# EAGLE design untitled (EAGLE 9.6.2)
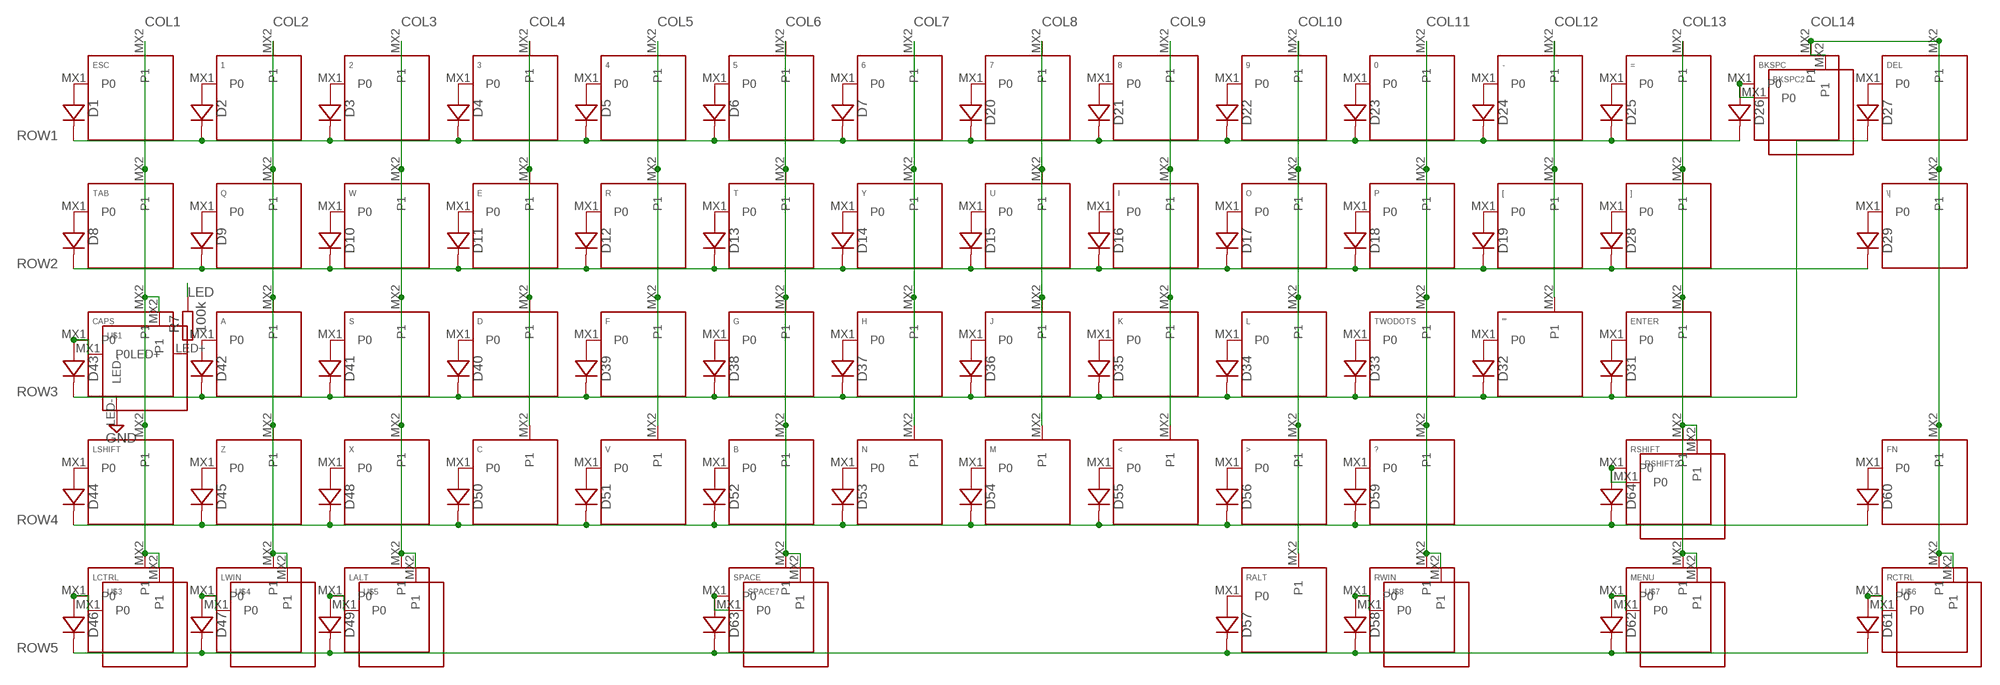
[diagram p0: schematic, sheet 1, part 1 of 2]
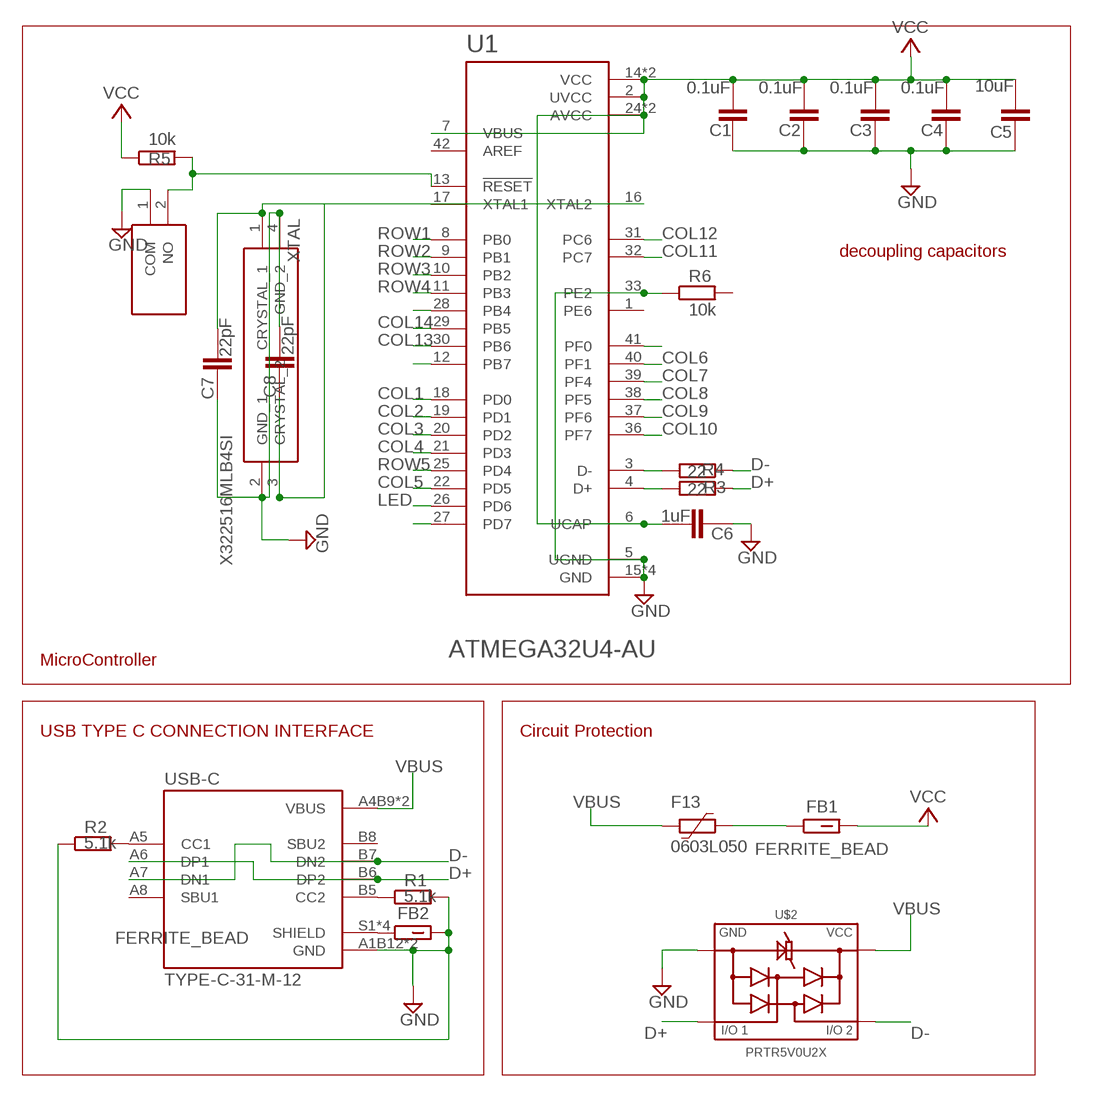
[diagram p1: schematic, sheet 1, part 2 of 2]

## Parts
0  KEYSWITCH-PLAIN-MX-1U  [MX-1U]
1  KEYSWITCH-PLAIN-MX-1U  [MX-1U]
2  KEYSWITCH-PLAIN-MX-1U  [MX-1U]
3  KEYSWITCH-PLAIN-MX-1U  [MX-1U]
4  KEYSWITCH-PLAIN-MX-1U  [MX-1U]
5  KEYSWITCH-PLAIN-MX-1U  [MX-1U]
6  KEYSWITCH-PLAIN-MX-1U  [MX-1U]
7  KEYSWITCH-PLAIN-MX-1U  [MX-1U]
8  KEYSWITCH-PLAIN-MX-1U  [MX-1U]
9  KEYSWITCH-PLAIN-MX-1U  [MX-1U]
'"  KEYSWITCH-PLAIN-MX-1U  [MX-1U]
-  KEYSWITCH-PLAIN-MX-1U  [MX-1U]
<  KEYSWITCH-PLAIN-MX-1U  [MX-1U]
=  KEYSWITCH-PLAIN-MX-1U  [MX-1U]
>  KEYSWITCH-PLAIN-MX-1U  [MX-1U]
?  KEYSWITCH-PLAIN-MX-1U  [MX-1U]
[  KEYSWITCH-PLAIN-MX-1U  [MX-1U]
\|  KEYSWITCH-PLAIN-MX-1U  [MX-1U]
]  KEYSWITCH-PLAIN-MX-1U  [MX-1U]
A  KEYSWITCH-PLAIN-MX-1U  [MX-1U]
B  KEYSWITCH-PLAIN-MX-1U  [MX-1U]
BKSPC  KEYSWITCH-PLAIN-MX-1U  [MX-1U]
BKSPC2  KEYSWITCH-PLAIN-MX-2U  [MX-2U]
C  KEYSWITCH-PLAIN-MX-1U  [MX-1U]
C1  0.1uF  CAPACITOR-0603  [C0603]
C2  0.1uF  CAPACITOR-0603  [C0603]
C3  0.1uF  CAPACITOR-0603  [C0603]
C4  0.1uF  CAPACITOR-0603  [C0603]
C5  10uF  CAPACITOR-0603  [C0603]
C6  1uF  CAPACITOR-0603  [C0603]
C7  22pF  CAPACITOR-0603  [C0603]
C8  22pF  CAPACITOR-0603  [C0603]
CAPS  KEYSWITCH-LED-MX-1U-LED  [MX-1U-LED]
D  KEYSWITCH-PLAIN-MX-1U  [MX-1U]
D1  DIODE-SOD-123  [SOD-123]
D2  DIODE-SOD-123  [SOD-123]
D3  DIODE-SOD-123  [SOD-123]
D4  DIODE-SOD-123  [SOD-123]
D5  DIODE-SOD-123  [SOD-123]
D6  DIODE-SOD-123  [SOD-123]
D7  DIODE-SOD-123  [SOD-123]
D8  DIODE-SOD-123  [SOD-123]
D9  DIODE-SOD-123  [SOD-123]
D10  DIODE-SOD-123  [SOD-123]
D11  DIODE-SOD-123  [SOD-123]
D12  DIODE-SOD-123  [SOD-123]
D13  DIODE-SOD-123  [SOD-123]
D14  DIODE-SOD-123  [SOD-123]
D15  DIODE-SOD-123  [SOD-123]
D16  DIODE-SOD-123  [SOD-123]
D17  DIODE-SOD-123  [SOD-123]
D18  DIODE-SOD-123  [SOD-123]
D19  DIODE-SOD-123  [SOD-123]
D20  DIODE-SOD-123  [SOD-123]
D21  DIODE-SOD-123  [SOD-123]
D22  DIODE-SOD-123  [SOD-123]
D23  DIODE-SOD-123  [SOD-123]
D24  DIODE-SOD-123  [SOD-123]
D25  DIODE-SOD-123  [SOD-123]
D26  DIODE-SOD-123  [SOD-123]
D27  DIODE-SOD-123  [SOD-123]
D28  DIODE-SOD-123  [SOD-123]
D29  DIODE-SOD-123  [SOD-123]
D31  DIODE-SOD-123  [SOD-123]
D32  DIODE-SOD-123  [SOD-123]
D33  DIODE-SOD-123  [SOD-123]
D34  DIODE-SOD-123  [SOD-123]
D35  DIODE-SOD-123  [SOD-123]
D36  DIODE-SOD-123  [SOD-123]
D37  DIODE-SOD-123  [SOD-123]
D38  DIODE-SOD-123  [SOD-123]
D39  DIODE-SOD-123  [SOD-123]
D40  DIODE-SOD-123  [SOD-123]
D41  DIODE-SOD-123  [SOD-123]
D42  DIODE-SOD-123  [SOD-123]
D43  DIODE-SOD-123  [SOD-123]
D44  DIODE-SOD-123  [SOD-123]
D45  DIODE-SOD-123  [SOD-123]
D46  DIODE-SOD-123  [SOD-123]
D47  DIODE-SOD-123  [SOD-123]
D48  DIODE-SOD-123  [SOD-123]
D49  DIODE-SOD-123  [SOD-123]
D50  DIODE-SOD-123  [SOD-123]
D51  DIODE-SOD-123  [SOD-123]
D52  DIODE-SOD-123  [SOD-123]
D53  DIODE-SOD-123  [SOD-123]
D54  DIODE-SOD-123  [SOD-123]
D55  DIODE-SOD-123  [SOD-123]
D56  DIODE-SOD-123  [SOD-123]
D57  DIODE-SOD-123  [SOD-123]
D58  DIODE-SOD-123  [SOD-123]
D59  DIODE-SOD-123  [SOD-123]
D60  DIODE-SOD-123  [SOD-123]
D61  DIODE-SOD-123  [SOD-123]
D62  DIODE-SOD-123  [SOD-123]
D63  DIODE-SOD-123  [SOD-123]
D64  DIODE-SOD-123  [SOD-123]
DEL  KEYSWITCH-PLAIN-MX-1U  [MX-1U]
E  KEYSWITCH-PLAIN-MX-1U  [MX-1U]
ENTER  KEYSWITCH-PLAIN-MX-2U  [MX-2U]
ESC  KEYSWITCH-PLAIN-MX-1U  [MX-1U]
F  KEYSWITCH-PLAIN-MX-1U  [MX-1U]
F13  0603L050  [0603L]
FB1  FERRITE_BEAD  FBCHIP-0603(1608-METRIC)  [BEADC1608X95N]
FB2  FERRITE_BEAD  FBCHIP-0603(1608-METRIC)  [BEADC1608X95N]
FN  KEYSWITCH-PLAIN-MX-1U  [MX-1U]
G  KEYSWITCH-PLAIN-MX-1U  [MX-1U]
H  KEYSWITCH-PLAIN-MX-1U  [MX-1U]
I  KEYSWITCH-PLAIN-MX-1U  [MX-1U]
J  KEYSWITCH-PLAIN-MX-1U  [MX-1U]
K  KEYSWITCH-PLAIN-MX-1U  [MX-1U]
L  KEYSWITCH-PLAIN-MX-1U  [MX-1U]
LALT  KEYSWITCH-PLAIN-MX-1U  [MX-1U]
LCTRL  KEYSWITCH-PLAIN-MX-1U  [MX-1U]
LSHIFT  KEYSWITCH-PLAIN-MX-2U  [MX-2U]
LWIN  KEYSWITCH-PLAIN-MX-1U  [MX-1U]
M  KEYSWITCH-PLAIN-MX-1U  [MX-1U]
MENU  KEYSWITCH-PLAIN-MX-1U  [MX-1U]
N  KEYSWITCH-PLAIN-MX-1U  [MX-1U]
O  KEYSWITCH-PLAIN-MX-1U  [MX-1U]
P  KEYSWITCH-PLAIN-MX-1U  [MX-1U]
Q  KEYSWITCH-PLAIN-MX-1U  [MX-1U]
R  KEYSWITCH-PLAIN-MX-1U  [MX-1U]
R1  5.1k  RESISTOR-0603  [R0603]
R2  5.1k  RESISTOR-0603  [R0603]
R3  22  RESISTOR-0603  [R0603]
R4  22  RESISTOR-0603  [R0603]
R5  10k  RESISTOR-0603  [R0603]
R6  10k  RESISTOR-0603  [R0603]
R7  100k  RESISTOR-0603  [R0603]
RALT  KEYSWITCH-PLAIN-MX-1U  [MX-1U]
RCTRL  KEYSWITCH-PLAIN-MX-1U  [MX-1U]
RSHIFT  KEYSWITCH-PLAIN-MX-1U  [MX-1U]
RSHIFT2  KEYSWITCH-PLAIN-MX-2U  [MX-2U]
RWIN  KEYSWITCH-PLAIN-MX-1U  [MX-1U]
S  KEYSWITCH-PLAIN-MX-1U  [MX-1U]
S1  EVP-AWBD2A  [EVPAWBD4A]
SPACE  KEYSWITCH-PLAIN-MX-6.25U-FLIPPED  [MX-6.25U-FLIPPED]
SPACE7  KEYSWITCH-PLAIN-MX-7U-FLIPPED  [MX-7U-FLIPPED]
T  KEYSWITCH-PLAIN-MX-1U  [MX-1U]
TAB  KEYSWITCH-PLAIN-MX-1U  [MX-1U]
TWODOTS  KEYSWITCH-PLAIN-MX-1U  [MX-1U]
U  KEYSWITCH-PLAIN-MX-1U  [MX-1U]
U1  ATMEGA32U4-AU  [QFP80P1200X1200X120-44N]
U$1  KEYSWITCH-PLAIN-MX-1U  [MX-1U]
U$2  PRTR5V0U2X  [PRTR5V0U2X]
U$3  KEYSWITCH-PLAIN-MX-1U  [MX-1U]
U$4  KEYSWITCH-PLAIN-MX-1U  [MX-1U]
U$5  KEYSWITCH-PLAIN-MX-1U  [MX-1U]
U$6  KEYSWITCH-PLAIN-MX-1U  [MX-1U]
U$7  KEYSWITCH-PLAIN-MX-1U  [MX-1U]
U$8  KEYSWITCH-PLAIN-MX-1U  [MX-1U]
USB-C  TYPE-C-31-M-12  [HRO_TYPE-C-31-M-12]
V  KEYSWITCH-PLAIN-MX-1U  [MX-1U]
W  KEYSWITCH-PLAIN-MX-1U  [MX-1U]
X  KEYSWITCH-PLAIN-MX-1U  [MX-1U]
XTAL  X322516MLB4SI  [X322516MLB4SI]
Y  KEYSWITCH-PLAIN-MX-1U  [MX-1U]
Z  KEYSWITCH-PLAIN-MX-1U  [MX-1U]

## Nets
COL1: CAPS.MX2(P1) ESC.MX2(P1) LCTRL.MX2(P1) LSHIFT.MX2(P1) TAB.MX2(P1) U1.18(PD0) U$1.MX2(P1) U$3.MX2(P1)
COL2: 1.MX2(P1) A.MX2(P1) LWIN.MX2(P1) Q.MX2(P1) U1.19(PD1) U$4.MX2(P1) Z.MX2(P1)
COL3: 2.MX2(P1) LALT.MX2(P1) S.MX2(P1) U1.20(PD2) U$5.MX2(P1) W.MX2(P1) X.MX2(P1)
COL4: 3.MX2(P1) C.MX2(P1) D.MX2(P1) E.MX2(P1) U1.21(PD3)
COL5: 4.MX2(P1) F.MX2(P1) R.MX2(P1) U1.22(PD5) V.MX2(P1)
COL6: 5.MX2(P1) B.MX2(P1) G.MX2(P1) SPACE7.MX2(P1) SPACE.MX2(P1) T.MX2(P1) U1.40(PF1)
COL7: 6.MX2(P1) H.MX2(P1) N.MX2(P1) U1.39(PF4) Y.MX2(P1)
COL8: 7.MX2(P1) J.MX2(P1) M.MX2(P1) U1.38(PF5) U.MX2(P1)
COL9: 8.MX2(P1) <.MX2(P1) I.MX2(P1) K.MX2(P1) U1.37(PF6)
COL10: 9.MX2(P1) >.MX2(P1) L.MX2(P1) O.MX2(P1) RALT.MX2(P1) U1.36(PF7)
COL11: 0.MX2(P1) ?.MX2(P1) P.MX2(P1) RWIN.MX2(P1) TWODOTS.MX2(P1) U1.32(PC7) U$8.MX2(P1)
COL12: '".MX2(P1) -.MX2(P1) [.MX2(P1) U1.31(PC6)
COL13: =.MX2(P1) ].MX2(P1) ENTER.MX2(P1) MENU.MX2(P1) RSHIFT2.MX2(P1) RSHIFT.MX2(P1) U1.30(PB6) U$7.MX2(P1)
COL14: \|.MX2(P1) BKSPC2.MX2(P1) BKSPC.MX2(P1) DEL.MX2(P1) FN.MX2(P1) RCTRL.MX2(P1) U1.29(PB5) U$6.MX2(P1)
D+: R4.1 U$2.2 USB-C.A6(DP1) USB-C.B6(DP2)
D-: R3.1 U$2.3 USB-C.A7(DN1) USB-C.B7(DN2)
GND: C1.1 C2.1 C3.1 C4.1 C5.1 C6.1 C7.1 C8.2 CAPS.LED- FB2.2 R1.2 R2.1 R6.1 S1.1(COM) U1.5(UGND) U1.15(GND) U1.23(GND) U1.33(PE2) U1.35(GND) U1.43(GND) U$2.1 USB-C.A1B12(GND) USB-C.B1A12(GND) XTAL.2(GND_1) XTAL.4(GND_2)
LED: R7.2 U1.26(PD6)
N$1: D1.A ESC.MX1(P0)
N$2: 1.MX1(P0) D2.A
N$3: 2.MX1(P0) D3.A
N$4: 3.MX1(P0) D4.A
N$5: 4.MX1(P0) D5.A
N$6: 5.MX1(P0) D6.A
N$7: 6.MX1(P0) D7.A
N$8: D8.A TAB.MX1(P0)
N$9: D9.A Q.MX1(P0)
N$10: D10.A W.MX1(P0)
N$11: D11.A E.MX1(P0)
N$12: D12.A R.MX1(P0)
N$13: D13.A T.MX1(P0)
N$14: D14.A Y.MX1(P0)
N$15: D15.A U.MX1(P0)
N$16: D16.A I.MX1(P0)
N$17: D17.A O.MX1(P0)
N$18: D18.A P.MX1(P0)
N$19: [.MX1(P0) D19.A
N$20: 7.MX1(P0) D20.A
N$21: 8.MX1(P0) D21.A
N$22: 9.MX1(P0) D22.A
N$23: 0.MX1(P0) D23.A
N$24: -.MX1(P0) D24.A
N$25: =.MX1(P0) D25.A
N$26: BKSPC2.MX1(P0) BKSPC.MX1(P0) D26.A
N$27: D27.A DEL.MX1(P0)
N$28: ].MX1(P0) D28.A
N$29: \|.MX1(P0) D29.A
N$30: C7.2 U1.17(XTAL1) XTAL.1(CRYSTAL_1)
N$31: D31.A ENTER.MX1(P0)
N$32: '".MX1(P0) D32.A
N$33: D33.A TWODOTS.MX1(P0)
N$34: D34.A L.MX1(P0)
N$35: D35.A K.MX1(P0)
N$36: D36.A J.MX1(P0)
N$37: D37.A H.MX1(P0)
N$38: D38.A G.MX1(P0)
N$39: D39.A F.MX1(P0)
N$40: D40.A D.MX1(P0)
N$41: D41.A S.MX1(P0)
N$42: A.MX1(P0) D42.A
N$43: CAPS.MX1(P0) D43.A U$1.MX1(P0)
N$44: D44.A LSHIFT.MX1(P0)
N$45: D45.A Z.MX1(P0)
N$46: D46.A LCTRL.MX1(P0) U$3.MX1(P0)
N$47: D47.A LWIN.MX1(P0) U$4.MX1(P0)
N$48: D48.A X.MX1(P0)
N$49: D49.A LALT.MX1(P0) U$5.MX1(P0)
N$50: C.MX1(P0) D50.A
N$51: D51.A V.MX1(P0)
N$52: B.MX1(P0) D52.A
N$53: D53.A N.MX1(P0)
N$54: D54.A M.MX1(P0)
N$55: <.MX1(P0) D55.A
N$56: >.MX1(P0) D56.A
N$57: D57.A RALT.MX1(P0)
N$58: D58.A RWIN.MX1(P0) U$8.MX1(P0)
N$59: ?.MX1(P0) D59.A
N$60: D60.A FN.MX1(P0)
N$61: D61.A RCTRL.MX1(P0) U$6.MX1(P0)
N$62: D62.A MENU.MX1(P0) U$7.MX1(P0)
N$63: D63.A SPACE7.MX1(P0) SPACE.MX1(P0)
N$64: D64.A RSHIFT2.MX1(P0) RSHIFT.MX1(P0)
N$65: C8.1 U1.16(XTAL2) XTAL.3(CRYSTAL_2)
N$66: R5.2 S1.2(NO) U1.13(!RESET)
N$67: CAPS.LED+ R7.1
N$68: R3.2 U1.3(D-)
N$69: R4.2 U1.4(D+)
N$76: U1.28(PB4)
N$79: U1.12(PB7)
N$87: U1.27(PD7)
N$90: U1.41(PF0)
N$97: R1.1 USB-C.B5(CC2)
N$98: R2.2 USB-C.A5(CC1)
N$105: F13.1 FB1.1
N$106: FB2.1 USB-C.S1(SHIELD) USB-C.S2(SHIELD) USB-C.S3(SHIELD) USB-C.S4(SHIELD)
ROW1: D1.C D2.C D3.C D4.C D5.C D6.C D7.C D20.C D21.C D22.C D23.C D24.C D25.C D26.C U1.8(PB0)
ROW2: D8.C D9.C D10.C D11.C D12.C D13.C D14.C D15.C D16.C D17.C D18.C D19.C D28.C D29.C U1.9(PB1)
ROW3: D27.C D31.C D32.C D33.C D34.C D35.C D36.C D37.C D38.C D39.C D40.C D41.C D42.C D43.C U1.10(PB2)
ROW4: D44.C D45.C D48.C D50.C D51.C D52.C D53.C D54.C D55.C D56.C D59.C D60.C D64.C U1.11(PB3)
ROW5: D46.C D47.C D49.C D57.C D58.C D61.C D62.C D63.C U1.25(PD4)
VBUS: F13.2 U$2.4 USB-C.A4B9(VBUS) USB-C.B4A9(VBUS)
VCC: C1.2 C2.2 C3.2 C4.2 C5.2 C6.2 FB1.2 R5.1 U1.2(UVCC) U1.6(UCAP) U1.7(VBUS) U1.14(VCC) U1.24(AVCC) U1.34(VCC) U1.44(AVCC)
Unconnected: R6.2 U1.1(PE6) U1.42(AREF) USB-C.A8(SBU1) USB-C.B8(SBU2)

## Notes on the sheet
- decoupling capacitors
- MicroController
- USB TYPE C CONNECTION INTERFACE | Circuit Protection

## Library data of the parts
0 1-9 '" - < = > ? [ \| ] A B BKSPC BKSPC2 C D DEL E ENTER ESC F FN G H I J K L LALT LCTRL LSHIFT LWIN M MENU N O P Q R RALT RCTRL RSHIFT RSHIFT2 RWIN S SPACE SPACE7 T TAB TWODOTS U U$1 U$3-U$8 V W X Y Z = Keyboard:KEYSWITCH-PLAIN
C1-C8 = Components:CAPACITOR
CAPS = Keyboard:KEYSWITCH-LED
D1-D29 D31-D64 = Components:DIODE: Standard 1N4148 diode
F13 = polyfuse-smd_20:?: Polyfuse Resettable PTC Source: http://www.littelfuse.com/products/resettable-ptcs.aspx; MF: Littelfuse; MPN: 0603L050; OC_FARNELL: 2125904; OC_NEWARK: 88T7683
FB1 FB2 = Filter:FB: Ferrite Bead - Generic; CATEGORY: Filter; SUB-CATEGORY: Ferrite bead
R1-R7 = Components:RESISTOR
S1 = EVP-AWBD2A:EVP-AWBD2A: Tactile Switches 3.0x2.0mm 1.6N 0.13mm Travel IP67 Source: Datasheet <https://componentsearchengine.com/Datasheets/1/EVP-AWBD2A.pdf>; DESCRIPTION: Tactile Switches 3.0x2.0mm 1.6N 0.13mm Travel IP67; HEIGHT: 0mm; MANUFACTURER_NAME: Panasonic; MANUFACTURER_PART_NUMBER: EVP-AWBD2A; MOUSER_PART_NUMBER: 667-EVP-AWBD2A; MOUSER_PRICE-STOCK: https://www.mouser.co.uk/ProductDetail/Panasonic/EVP-AWBD2A?qs=dApJwNzDUnzvNWqpScI7Lg%3D%3D
U1 = ATMEGA32U4-AU:ATMEGA32U4-AU: ATmega Series 16 MHz 32 KB Flash 2.5 KB SRAM 8-Bit Microcontroller - TQFP-44 Check prices <https://pricing.snapeda.com/parts/ATMEGA32U4-AU/Microchip%20Technology/view-part?ref=eda>; AVAILABILITY: In Stock; DESCRIPTION: AVR AVR® ATmega Microcontroller IC 8-Bit 16MHz 32KB (16K x 16) FLASH 44-TQFP (10x10); MF: Microchip Technology; MP: ATMEGA32U4-AU; PACKAGE: TQFP-44 Microchip Technology / Atmel; PRICE: None
U$2 = Controller:PRTR5V0U2X
USB-C = TYPE-C-31-M-12:TYPE-C-31-M-12: USB Connectors 24 Receptacle 1 8.94*7.3mm RoHS; AVAILABILITY: Unavailable; DESCRIPTION: USB Connectors 24 Receptacle 1 8.94*7.3mm RoHS; MF: HRO Electronics Co., Ltd.; MP: TYPE-C-31-M-12; PACKAGE: Package; PRICE: None
XTAL = X322516MLB4SI:X322516MLB4SI: Crystal Source: Datasheet <https://datasheet.lcsc.com/szlcsc/Yangxing-Tech-X322516MLB4SI_C13738.pdf>; DESCRIPTION: Crystal; HEIGHT: 0.8mm; MANUFACTURER_NAME: Yangxing Tech; MANUFACTURER_PART_NUMBER: X322516MLB4SI

## Board
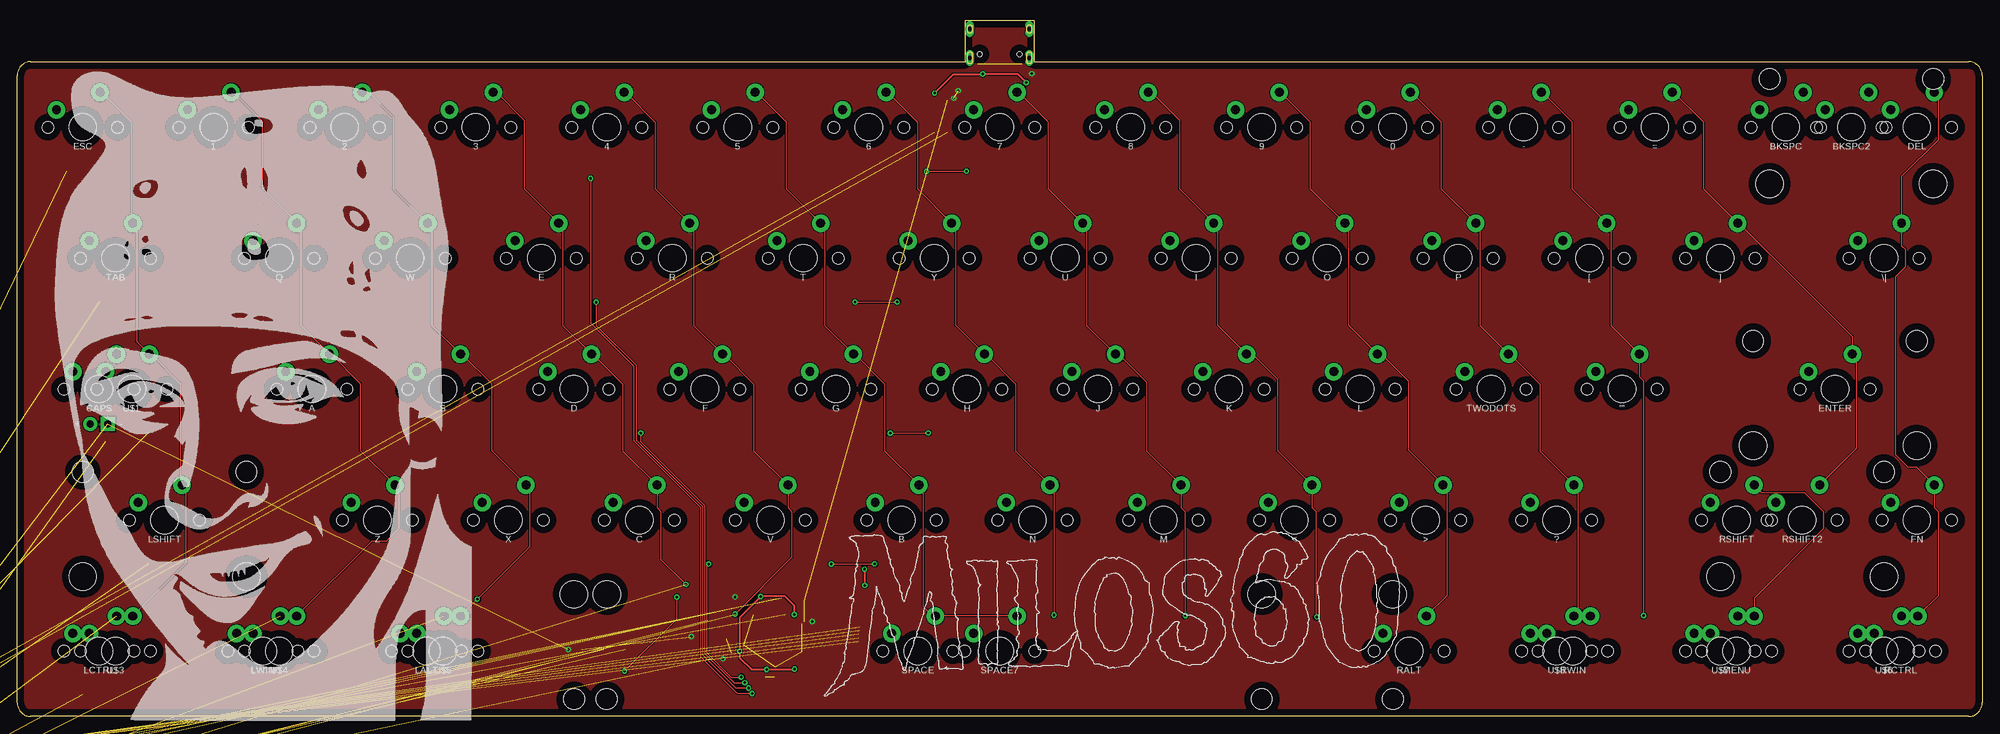
[diagram p2: board, top side]
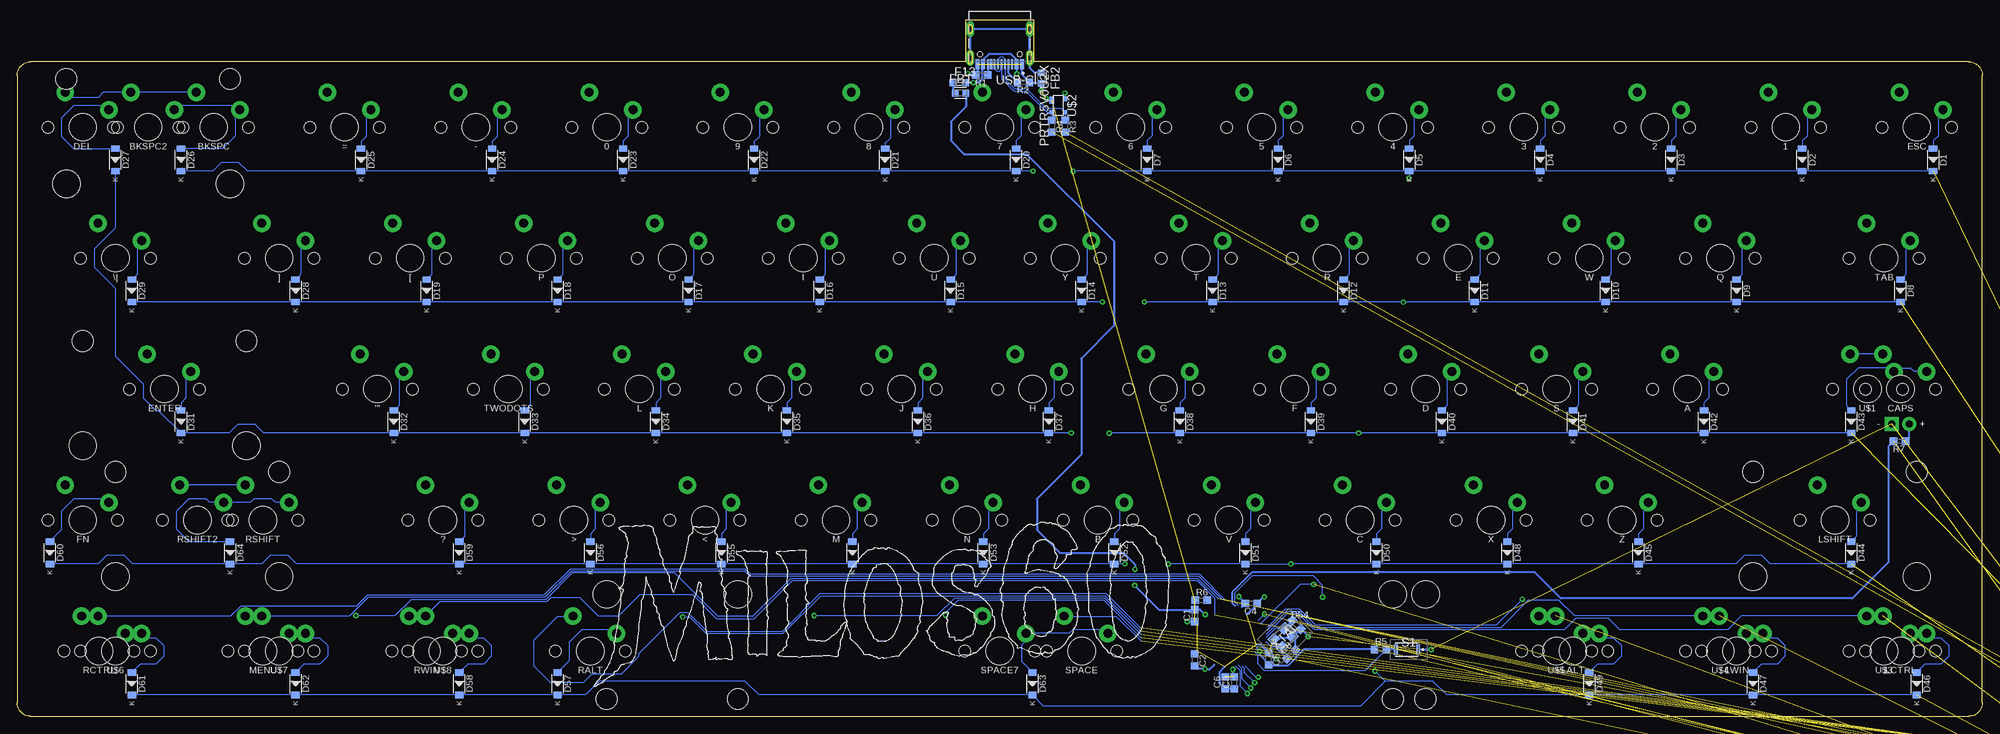
[diagram p3: board, bottom side, seen from below]

Size 285.75 x 101.25 mm. Coordinates in mm from the lower left corner, seen from the top.
Outline: 2,95.25 137.88,95.25 137.88,101.25 147.88,101.25 147.88,95.25 283.75,95.25 arc-90 285.75,93.25 285.75,2 arc-90 283.75,0 2,0 arc-90 0,2 0,93.25 arc-90 2,95.25
Copper layers (1*16): Top 0.035mm / dielectric 1.5mm / Bottom 0.035mm
Design rules "default": minimum track width 6mil, minimum drill 0.35mm, track to track 6mil, track to pad 6mil, pad to pad 6mil, via to via 6mil, smd to smd 6mil, copper to edge 40mil, drill to drill 6mil, minimum pad ring 10mil, minimum via ring 8mil, stop-mask expansion 4mil, vias tented up to drill 0mil, thermal gap 10mil

### Footprints (pad centres in the part's own frame; a part is rotated, then mirrored left to right if it is on the bottom)
MX-1U = drill 1.3 pad 2.54: MX1 -3.81,2.54; MX2 2.54,5.08 | hole 4: 0,0 | hole 1.7: -5.08,0; 5.08,0
MX-2U = drill 1.3 pad 2.54: MX1 -3.81,2.54; MX2 2.54,5.08 | hole 4: 0,0; -11.9,-8.24; 11.9,-8.24 | hole 1.7: -5.08,0; 5.08,0 | hole 3.05: -11.9,7; 11.9,7
C0603 = smd 1.05 x 1.08: 1 -0.875,0; 2 0.875,0
MX-1U-LED = drill 1 pad 2: LED+ -1.27,-5.08 | drill 1 pad 2 square: LED- 1.27,-5.08 | drill 1.3 pad 2.54: MX1 -3.81,2.54; MX2 2.54,5.08 | hole 4: 0,0 | hole 1.7: -5.08,0; 5.08,0
SOD-123 = smd 0.91 x 1.22: A -1.635,0; C 1.635,0
0603L = smd 1 x 1: 1 -0.9,0; 2 0.9,0
BEADC1608X95N = smd 0.9 x 0.97: 1 -0.785,0 | smd 0.933 x 0.97: 2 0.769,0
R0603 = smd 1.05 x 1.08: 1 -0.875,0; 2 0.875,0
EVPAWBD4A = smd 0.55 x 1.5: 1 1.375,0; 2 -1.875,0
MX-6.25U-FLIPPED = drill 1.3 pad 2.54: MX1 -3.81,2.54; MX2 2.54,5.08 | hole 4: 0,0; -50,8.24; 50,8.24 | hole 1.7: -5.08,0; 5.08,0 | hole 3.05: -50,-7; 50,-7
MX-7U-FLIPPED = drill 1.3 pad 2.54: MX1 -3.81,2.54; MX2 2.54,5.08 | hole 4: 0,0; -57.15,8.24; 57.15,8.24 | hole 1.7: -5.08,0; 5.08,0 | hole 3.05: -57.15,-7; 57.15,-7
QFP80P1200X1200X120-44N = smd 1.5 x 0.5: 1 -5.9,4; 2 -5.9,3.2; 3 -5.9,2.4; 4 -5.9,1.6; 5 -5.9,0.8; 6 -5.9,0; 7 -5.9,-0.8; 8 -5.9,-1.6; 9 -5.9,-2.4; 10 -5.9,-3.2; 11 -5.9,-4; 23 5.9,-4; 24 5.9,-3.2; 25 5.9,-2.4; 26 5.9,-1.6; 27 5.9,-0.8; 28 5.9,0; 29 5.9,0.8; 30 5.9,1.6; 31 5.9,2.4; 32 5.9,3.2; 33 5.9,4 | smd 0.5 x 1.5: 12 -4,-5.9; 13 -3.2,-5.9; 14 -2.4,-5.9; 15 -1.6,-5.9; 16 -0.8,-5.9; 17 0,-5.9; 18 0.8,-5.9; 19 1.6,-5.9; 20 2.4,-5.9; 21 3.2,-5.9; 22 4,-5.9; 34 4,5.9; 35 3.2,5.9; 36 2.4,5.9; 37 1.6,5.9; 38 0.8,5.9; 39 0,5.9; 40 -0.8,5.9; 41 -1.6,5.9; 42 -2.4,5.9; 43 -3.2,5.9; 44 -4,5.9
PRTR5V0U2X = smd 1 x 0.6: 1 -0.75,-0.95 | smd 0.6 x 0.6: 2 0.95,-0.95; 3 0.95,0.95; 4 -0.95,0.95
HRO_TYPE-C-31-M-12 = smd 0.6 x 1.45: A1B12 -3.25,5.095; A4B9 -2.45,5.095; B1A12 3.25,5.095; B4A9 2.45,5.095 | smd 0.3 x 1.45: A5 -1.25,5.095; A6 -0.25,5.095; A7 0.25,5.095; A8 1.25,5.095; B5 1.75,5.095; B6 0.75,5.095; B7 -0.75,5.095; B8 -1.75,5.095 | drill 0.65 pad 1.05 long: S1 -4.32,4.18; S2 4.32,4.18; S3 -4.32,0; S4 4.32,0 | hole 0.7: -2.89,3.65; 2.89,3.65
X322516MLB4SI = smd 1.4 x 1.2: 1 -1.1,-0.85; 2 1.1,-0.85; 3 1.1,0.85; 4 -1.1,0.85

### Placement (x,y rotation side)
0  200.02,85.73 0 top
1  28.57,85.73 0 top
2  47.62,85.73 0 top
3  66.67,85.73 0 top
4  85.72,85.73 0 top
5  104.77,85.73 0 top
6  123.82,85.73 0 top
7  142.87,85.73 0 top
8  161.92,85.73 0 top
9  180.97,85.73 0 top
'"  233.36,47.63 0 top
-  219.07,85.73 0 top
<  185.74,28.58 0 top
=  238.12,85.73 0 top
>  204.79,28.58 0 top
?  223.84,28.58 0 top
[  228.6,66.68 0 top
\|  271.46,66.68 0 top
]  247.65,66.68 0 top
A  42.86,47.63 0 top
B  128.59,28.58 0 top
BKSPC  257.17,85.73 0 top
BKSPC2  266.7,85.73 0 top
C  90.49,28.58 0 top
C1  114.5,14.67 90 bottom
C2  114.51,8.24 270 bottom
C3  108.78,4.9 90 bottom
C4  106.31,16.46 180 bottom
C5  103.79,8.38 270 bottom
C6  110.1,4.9 90 bottom
C7  99.73,13.34 135 bottom
C8  100.5,9.06 45 bottom
CAPS  11.91,47.63 0 top
D  80.96,47.63 0 top
D1  7.14,80.96 270 bottom
D2  26.19,80.96 270 bottom
D3  45.24,80.96 270 bottom
D4  64.29,80.96 270 bottom
D5  83.34,80.96 270 bottom
D6  102.39,80.96 270 bottom
D7  121.44,80.96 270 bottom
D8  11.91,61.91 270 bottom
D9  35.72,61.91 270 bottom
D10  54.77,61.91 270 bottom
D11  73.82,61.91 270 bottom
D12  92.87,61.91 270 bottom
D13  111.92,61.91 270 bottom
D14  130.97,61.91 270 bottom
D15  150.02,61.91 270 bottom
D16  169.07,61.91 270 bottom
D17  188.12,61.91 270 bottom
D18  207.17,61.91 270 bottom
D19  226.22,61.91 270 bottom
D20  140.49,80.96 270 bottom
D21  159.54,80.96 270 bottom
D22  178.59,80.96 270 bottom
D23  197.64,80.96 270 bottom
D24  216.69,80.96 270 bottom
D25  235.74,80.96 270 bottom
D26  261.94,80.96 270 bottom
D27  271.46,80.96 270 bottom
D28  245.27,61.91 270 bottom
D29  269.08,61.91 270 bottom
D31  261.94,42.86 270 bottom
D32  230.98,42.86 270 bottom
D33  211.93,42.86 270 bottom
D34  192.88,42.86 270 bottom
D35  173.83,42.86 270 bottom
D36  154.78,42.86 270 bottom
D37  135.73,42.86 270 bottom
D38  116.68,42.86 270 bottom
D39  97.63,42.86 270 bottom
D40  78.58,42.86 270 bottom
D41  59.53,42.86 270 bottom
D42  40.48,42.86 270 bottom
D43  19.05,42.86 270 bottom
D44  19.05,23.81 270 bottom
D45  50.01,23.81 270 bottom
D46  9.52,4.76 270 bottom
D47  33.34,4.76 270 bottom
D48  69.06,23.81 270 bottom
D49  57.15,4.76 270 bottom
D50  88.11,23.81 270 bottom
D51  107.16,23.81 270 bottom
D52  126.21,23.81 270 bottom
D53  145.26,23.81 270 bottom
D54  164.31,23.81 270 bottom
D55  183.36,23.81 270 bottom
D56  202.41,23.81 270 bottom
D57  207.17,4.76 270 bottom
D58  221.46,4.76 270 bottom
D59  221.46,23.81 270 bottom
D60  280.99,23.81 270 bottom
D61  269.08,4.76 270 bottom
D62  245.27,4.76 270 bottom
D63  138.11,4.76 270 bottom
D64  254.79,23.81 270 bottom
DEL  276.22,85.73 0 top
E  76.2,66.68 0 top
ENTER  264.32,47.63 0 top
ESC  9.52,85.73 0 top
F  100.01,47.63 0 top
F13  148.75,92.21 0 bottom
FB1  148.57,90.68 0 bottom
FB2  136.85,92.88 270 bottom
FN  276.22,28.58 0 top
G  119.06,47.63 0 top
H  138.11,47.63 0 top
I  171.45,66.68 0 top
J  157.16,47.63 0 top
K  176.21,47.63 0 top
L  195.26,47.63 0 top
LALT  59.53,9.53 0 top
LCTRL  11.91,9.53 0 top
LSHIFT  21.43,28.58 0 top
LWIN  35.72,9.53 0 top
M  166.69,28.58 0 top
MENU  250.03,9.53 0 top
N  147.64,28.58 0 top
O  190.5,66.68 0 top
P  209.55,66.68 0 top
Q  38.1,66.68 0 top
R  95.25,66.68 0 top
R1  145.48,93.31 180 bottom
R2  139.41,92.26 180 bottom
R3  133.38,85.88 270 bottom
R4  135.3,85.88 270 bottom
R5  87.54,9.74 0 bottom
R6  113.58,16.9 0 bottom
R7  12.03,40.04 180 bottom
RALT  202.41,9.53 0 top
RCTRL  273.84,9.53 0 top
RSHIFT  250.03,28.58 0 top
RSHIFT2  259.56,28.58 0 top
RWIN  226.22,9.53 0 top
S  61.91,47.63 0 top
S1  83.41,9.73 0 bottom
SPACE  130.97,9.53 0 top
SPACE7  142.87,9.53 0 top
T  114.3,66.68 0 top
TAB  14.29,66.68 0 top
TWODOTS  214.31,47.63 0 top
U  152.4,66.68 0 top
U1  -32.77,-14 0 top  (outside the outline)
U$1  16.67,47.63 0 top
U$2  134.36,88.88 270 bottom
U$3  14.29,9.53 0 top
U$4  38.1,9.53 0 top
U$5  61.91,9.53 0 top
U$6  271.46,9.53 0 top
U$7  247.65,9.53 0 top
U$8  223.84,9.53 0 top
USB-C  142.86,99.99 180 bottom
V  109.54,28.58 0 top
W  57.15,66.68 0 top
X  71.44,28.58 0 top
XTAL  101.67,11.44 225 bottom
Y  133.35,66.68 0 top
Z  52.39,28.58 0 top

### Tracks (layer width: path | path; a pad name or v marks a point on that pad's centre or on a via)
COL1  (1 unrouted)
  Top 0.152: ESC.MX2 12.29,90.81 16.56,86.53 16.56,72.02 TAB.MX2 16.83,71.47 17.38,70.92 17.38,54.53 U$1.MX2 19.49,52.71 23.74,48.46 23.74,33.89 LSHIFT.MX2 24.01,33.66 24.52,33.14 24.52,22.3 U$3.MX2 LCTRL.MX2
  Bottom 0.152: CAPS.MX2 U$1.MX2 | U$3.MX2 35.04,14.61 37.03,12.62 52.71,12.62 54.38,14.29 59.1,14.29 60.77,12.62 97.14,12.62 99.46,14.94 101.12,14.94 104.12,11.94
COL2  (1 unrouted)
  Top 0.152: 1.MX2 31.42,90.81 35.61,86.61 35.61,76.95 40.64,71.92 Q.MX2 40.64,71.7 41.19,71.15 41.19,56.92 A.MX2 45.63,52.71 49.88,48.45 49.88,38.7 Z.MX2 54.93,33.6 55.48,33.05 55.48,27.29 53.67,25.48 51.52,25.48 U$4.MX2 LWIN.MX2
  Bottom 0.152: U$4.MX2 59.25,14.61 61.55,16.9 66.05,16.9 70.02,12.93 97.01,12.93 99.33,15.25 101.25,15.25 104.05,12.44
COL3  (via drill 0.35)  (1 unrouted)
  Top 0.152: 2.MX2 51.07,90.81 54.7,87.18 54.7,76.74 W.MX2 59.71,71.78 59.88,71.78 60.29,71.37 60.29,56.87 S.MX2 64.48,52.68 64.68,52.68 68.95,48.41 68.95,38.68 X.MX2 74.08,33.66 74.53,33.21 74.53,24.68 v66.9,17.05 U$5.MX2 LALT.MX2
  Bottom 0.152: v66.9,17.05 70.72,13.23 96.88,13.23 99.2,15.55 101.37,15.55 103.98,12.94
COL4  (via drill 0.35)  (1 unrouted)
  Top 0.152: 3.MX2 69.68,90.81 73.72,86.77 73.72,76.78 E.MX2 78.83,71.85 78.86,71.85 79.32,71.39 79.32,56.89 D.MX2 83.71,52.71 88.03,48.39 88.03,38.66 C.MX2 93.03,30.41 93.58,29.86 93.58,22.87 v97.23,19.22
  Bottom 0.152: 104.96,13.44 99.18,19.22 v97.23,19.22
COL5  (via drill 0.35)  (1 unrouted)
  Top 0.152: 4.MX2 88.3,90.84 88.44,90.84 92.79,86.48 92.79,76.75 R.MX2 97.8,71.77 97.98,71.77 98.37,71.39 98.37,56.89 F.MX2 102.77,52.69 107.11,48.36 107.11,38.63 V.MX2 112.08,30.41 112.63,29.86 112.63,23.13 v104.38,14.88
  Bottom 0.152: v104.38,14.88 105.31,13.94
COL6  (1 unrouted)
  Top 0.152: 5.MX2 107.35,90.84 107.49,90.84 111.82,86.51 111.82,76.78 T.MX2 116.88,71.71 117.09,71.71 117.4,71.4 117.4,56.91 G.MX2 121.82,52.69 126.15,48.37 126.15,38.63 B.MX2 131.72,33.06 131.72,15.99 133.11,14.61 SPACE.MX2 SPACE7.MX2
  Bottom 0.152: SPACE.MX2 133.5,14.59 125.95,14.59 122.3,10.94
COL7  (via drill 0.35)  (1 unrouted)
  Top 0.152: 6.MX2 126.38,90.79 126.58,90.79 130.89,86.48 130.89,76.75 Y.MX2 135.91,71.76 136.44,71.22 136.44,56.92 H.MX2 140.71,52.64 140.92,52.64 145.2,48.37 145.2,38.63 N.MX2 150.76,33.07 v150.76,14.75
  Bottom 0.152: v150.76,14.75 150.76,15.05 148.87,16.94 127.82,16.94 122.32,11.44
COL8  (via drill 0.35)  (1 unrouted)
  Top 0.152: 7.MX2 145.45,90.84 145.59,90.84 149.9,86.53 149.9,76.8 U.MX2 154.96,71.78 155.13,71.78 155.52,71.39 155.52,56.89 J.MX2 160.17,52.71 164.23,48.65 164.23,38.65 M.MX2 169.23,30.41 169.78,29.86 169.78,14.76 v169.86,14.68
  Bottom 0.152: v169.86,14.68 151.99,14.68 149.41,17.25 127.68,17.25 122.37,11.94
COL9  (via drill 0.35)  (1 unrouted)
  Top 0.152: 8.MX2 164.91,90.81 168.98,86.74 168.98,76.77 I.MX2 174.01,71.76 174.54,71.22 174.54,56.92 K.MX2 179.63,52.71 183.25,49.09 183.25,38.68 <.MX2 188.28,30.41 188.83,29.86 188.83,14.62 v188.97,14.48
  Bottom 0.152: v188.97,14.48 188,14.48 185.59,12.06 174.37,12.06 168.87,17.57 127.55,17.57 122.43,12.44
COL10  (1 unrouted)
  Top 0.152: 9.MX2 183.54,90.83 183.7,90.83 188,86.53 188,76.8 O.MX2 193.04,71.74 193.59,71.18 193.59,56.92 L.MX2 198.39,52.71 202.29,48.81 202.29,38.76 207.33,33.73 >.MX2 207.88,33.1 207.88,17.54 RALT.MX2
  Bottom 0.152: 122.49,12.94 127.42,17.88 168.99,17.88 174.49,12.37 185.46,12.37 188.17,15.08 189.43,15.08 195.38,9.12 195.38,8.72 197.95,6.16 202.19,6.16 203.46,4.88 208.16,4.88 210.55,7.27 210.55,11.13 207.14,14.55 205,14.55 RALT.MX2
COL11  (1 unrouted)
  Top 0.152: 0.MX2 202.59,90.83 202.75,90.83 207.05,86.52 207.05,76.79 P.MX2 212.13,71.72 212.33,71.72 212.67,71.39 212.67,56.89 TWODOTS.MX2 216.87,52.72 217.04,52.72 221.38,48.38 221.38,38.65 ?.MX2 226.93,33.1 226.93,15.45 226.38,14.9 U$8.MX2 RWIN.MX2
  Bottom 0.152: U$8.MX2 224.25,16.73 208.68,16.73 208.09,17.33 203.97,17.33 201.28,14.64 198.27,14.64 195.16,17.75 187.56,17.75 184.03,14.22 178.63,14.22 173.04,19.81 114.23,19.81 111.65,17.23 111.65,14.8 111.65,14.79
COL12  (via drill 0.35)  (1 unrouted)
  Top 0.152: -.MX2 221.64,90.83 221.8,90.83 226.1,86.53 226.1,76.8 [.MX2 231.15,71.74 231.36,71.74 231.72,71.39 231.72,56.89 '".MX2 235.9,49.46 236.45,48.91 236.45,14.72 v236.49,14.68
  Bottom 0.152: v236.49,14.68 230.8,14.68 228.42,17.06 208.83,17.06 205.03,20.86 190.19,20.86 183.86,14.53 178.82,14.53 173.24,20.11 114.1,20.11 111.17,17.18
COL13  (1 unrouted)
  Top 0.152: =.MX2 240.69,90.83 240.85,90.83 245.15,86.53 245.15,76.8 ].MX2 250.21,71.78 250.38,71.78 266.86,55.29 ENTER.MX2 266.87,52.71 267.41,52.16 267.41,38.97 RSHIFT2.MX2 | RSHIFT.MX2 253.61,32.61 259.89,32.61 262.65,29.86 262.65,27.29 252.57,17.22 MENU.MX2 U$7.MX2
  Bottom 0.152: RSHIFT.MX2 RSHIFT2.MX2 | U$7.MX2 237.42,14.61 234.66,17.36 208.95,17.36 205.14,21.17 180,21.17 179.25,20.42 113.97,20.42 110.67,17.11
COL14  (1 unrouted)
  Top 0.152: U$6.MX2 RCTRL.MX2 279.32,17.54 279.32,29.86 278.76,30.41 FN.MX2 276.13,36.29 274.94,36.29 273.13,38.1 273.13,63.95 274.55,65.37 274.55,67.96 274,68.51 \|.MX2 274,78.5 279.34,83.84 279.34,90.23 DEL.MX2
  Bottom 0.152: BKSPC.MX2 BKSPC2.MX2 273.22,90.81 273.92,90.11 278.76,90.11 DEL.MX2 | U$6.MX2 254.69,14.61 253.19,16.1 236.36,16.1 234.79,17.67 209.11,17.67 205.3,21.49 179.89,21.49 179.12,20.72 113.85,20.72 110.17,17.04
D+
  Bottom 0.152: USB-C.B6 143.61,94.2 143.3,93.88 142.92,93.88 142.61,94.2 USB-C.A6 142.61,92.77 140.82,90.97 139.07,90.97 136.02,87.93 U$2.2 135.31,86.77 R4.1
D-
  Bottom 0.152: USB-C.A7 143.11,95.62 142.82,95.92 142.4,95.92 142.11,95.63 USB-C.B7 142.11,92.7 140.7,91.29 138.95,91.29 136.14,88.48 133.96,88.48 U$2.3 133.38,87.91 R3.1
GND  (via drill 0.35)  (17 unrouted)
  Bottom 0.152: 139.61,94.82 USB-C.A1B12
  Bottom 0.305: USB-C.B1A12 146.11,93.55 R1.2 147.33,93.31 v147.54,93.52 | 139.61,94.82 139.61,93.34 R2.1 138.38,92.11 FB2.2 v136.85,91.02 | XTAL.4 100.48,11.42 | C8.2 99.88,11.21 XTAL.4 | XTAL.4 100.23,11.61 C7.1 v98.02,11.62 | 106.99,14.79 105.43,16.35 C4.1 104.5,17.39 v104.39,17.39 | 110.17,7.21 110.95,6.43 110.95,4.87 C6.1 C3.1 | 114.1,9.44 114.43,9.11 C2.1 | 105.59,10.44 105.58,10.45 105,10.45 C5.1 102.93,8.39 v102.63,8.39 | 102.51,11.39 102.65,11.26 XTAL.2 102.88,11.43 100.47,11.43 XTAL.4 | S1.1 80.16,9.73 v80.15,9.74 | v115.62,13.79 v115.61,13.8 C1.1 114.14,13.44 | U$2.1 135.85,89.63 v136.17,89.96
  pour Top: 6.43,135.24 -25.49,103.32 -25.49,-5.32 -24.09,-6.72 -7.29,-23.52 25.75,-23.52 293.71,-23.52 311.91,-5.32 311.91,97.16 276.63,132.44 273.83,135.24
LED  (1 unrouted)
  Bottom 0.305: R7.2 13.65,39.29 13.65,22.44 18.92,17.17 61.27,17.17 65.04,20.93 106.21,20.93 109.1,18.04 109.1,16.56 108.67,16.12
N$1
  Bottom 0.152: D1.A 7.14,83.73 6.43,84.44 6.43,87.55 ESC.MX1
N$2
  Bottom 0.152: D2.A 26.19,83.73 25.48,84.44 25.48,87.55 1.MX1
N$3
  Bottom 0.152: D3.A 45.24,83.73 44.53,84.44 44.53,87.55 2.MX1
N$4
  Bottom 0.152: D4.A 64.29,83.73 63.58,84.44 63.58,87.55 3.MX1
N$5
  Bottom 0.152: D5.A 83.34,83.73 82.63,84.44 82.63,87.55 4.MX1
N$6
  Bottom 0.152: D6.A 102.39,83.73 101.68,84.44 101.68,87.55 5.MX1
N$7
  Bottom 0.152: D7.A 121.44,83.73 120.73,84.44 120.73,87.55 6.MX1
N$8
  Bottom 0.152: TAB.MX1 10.48,69.2 11.15,68.53 11.15,64.3 D8.A
N$9
  Bottom 0.152: Q.MX1 34.96,68.55 34.96,64.3 D9.A
N$10
  Bottom 0.152: W.MX1 53.34,69.19 54.01,68.52 54.01,64.3 D10.A
N$11
  Bottom 0.152: E.MX1 73.06,68.55 73.06,64.3 D11.A
N$12
  Bottom 0.152: R.MX1 92.11,68.55 92.11,64.3 D12.A
N$13
  Bottom 0.152: T.MX1 110.49,69.17 111.16,68.5 111.16,64.3 D13.A
N$14
  Bottom 0.152: Y.MX1 130.21,68.55 130.21,64.3 D14.A
N$15
  Bottom 0.152: U.MX1 149.26,68.55 149.26,64.3 D15.A
N$16
  Bottom 0.152: I.MX1 167.64,69.19 168.31,68.52 168.31,64.3 D16.A
N$17
  Bottom 0.152: O.MX1 187.36,68.55 187.36,64.3 D17.A
N$18
  Bottom 0.152: P.MX1 205.77,69.22 206.41,68.57 206.41,64.3 D18.A
N$19
  Bottom 0.152: [.MX1 225.46,68.55 225.46,64.3 D19.A
N$20
  Bottom 0.152: D20.A 140.49,83.73 139.78,84.44 139.78,87.55 7.MX1
N$21
  Bottom 0.152: 8.MX1 158.11,88.2 158.79,87.53 158.79,84.15 159.54,83.4 D21.A
N$22
  Bottom 0.152: 9.MX1 177.16,88 177.84,87.33 177.84,84.35 178.59,83.6 D22.A
N$23
  Bottom 0.152: 0.MX1 196.21,88 196.89,87.33 196.89,84.45 197.64,83.7 D23.A
N$24
  Bottom 0.152: -.MX1 215.26,87.9 215.94,87.23 215.94,84.35 216.69,83.6 D24.A
N$25
  Bottom 0.152: =.MX1 234.31,87.9 234.99,87.23 234.99,84.35 235.74,83.6 D25.A
N$26
  Bottom 0.152: BKSPC2.MX1 262.89,88.28 262.36,88.82 253.89,88.82 253.36,88.29 BKSPC.MX1 253.36,87.77 254.08,87.05 254.08,84.44 255.93,82.6 D26.A
N$27
  Bottom 0.152: DEL.MX1 272.49,88.27 273.04,88.82 277.51,88.82 279.32,87.01 279.32,84.44 277.51,82.63 271.5,82.63 D27.A
N$28
  Bottom 0.152: ].MX1 244.51,68.55 244.51,64.3 D28.A
N$29
  Bottom 0.152: \|.MX1 268.32,68.55 268.32,64.3 D29.A
N$30  (1 unrouted)
  Bottom 0.152: C7.2 XTAL.1 102.79,12.82 104.17,11.44
N$31
  Bottom 0.152: D31.A 261.94,45.63 261.23,46.34 261.23,49.45 ENTER.MX1
N$32
  Bottom 0.152: '".MX1 229.55,50.04 230.22,49.37 230.22,45.25 D32.A
N$33
  Bottom 0.152: TWODOTS.MX1 210.5,50.07 211.17,49.4 211.17,45.25 D33.A
N$34
  Bottom 0.152: D34.A 192.88,45.63 192.17,46.34 192.17,49.45 L.MX1
N$35
  Bottom 0.152: D35.A 173.83,45.63 173.12,46.34 173.12,49.45 K.MX1
N$36
  Bottom 0.152: D36.A 154.78,45.63 154.07,46.34 154.07,49.45 J.MX1
N$37
  Bottom 0.152: D37.A 135.73,45.63 135.02,46.34 135.02,49.45 H.MX1
N$38
  Bottom 0.152: D38.A 116.68,45.63 115.97,46.34 115.97,49.45 G.MX1
N$39
  Bottom 0.152: D39.A 97.63,45.63 96.92,46.34 96.92,49.45 F.MX1
N$40
  Bottom 0.152: D.MX1 77.15,50.1 77.82,49.43 77.82,45.25 D40.A
N$41
  Bottom 0.152: S.MX1 58.77,49.49 58.77,45.25 D41.A
N$42
  Bottom 0.152: D42.A 40.48,45.63 39.77,46.34 39.77,49.45 A.MX1
N$43
  Bottom 0.152: CAPS.MX1 9.91,50.17 10.46,50.72 12.86,50.72 U$1.MX1 13.48,50.79 17.98,50.79 19.76,49.01 19.76,45.21 D43.A
N$44
  Bottom 0.152: LSHIFT.MX1 17.69,31.12 18.29,30.52 18.29,26.2 D44.A
N$45
  Bottom 0.152: D45.A 50.01,26.58 49.29,27.29 49.29,30.4 Z.MX1
N$46
  Bottom 0.152: U$3.MX1 LCTRL.MX1 7.5,11.47 6.02,11.47 4.88,10.33 4.88,8.72 6.02,7.58 8.34,7.58 D46.A
N$47
  Bottom 0.152: U$4.MX1 LWIN.MX1 31.31,11.47 29.83,11.47 28.7,10.33 28.7,8.72 29.83,7.58 32.15,7.58 D47.A
N$48
  Bottom 0.152: D48.A 69.06,26.58 68.34,27.29 68.34,30.4 X.MX1
N$49
  Bottom 0.152: U$5.MX1 LALT.MX1 55.12,11.47 53.65,11.47 52.51,10.33 52.51,8.72 53.65,7.58 55.96,7.58 D49.A
N$50
  Bottom 0.152: D50.A 88.11,26.58 87.39,27.29 87.39,30.4 C.MX1
N$51
  Bottom 0.152: D51.A 107.16,26.58 106.44,27.29 106.44,30.4 V.MX1
N$52
  Bottom 0.152: D52.A 126.21,26.58 125.49,27.29 125.49,30.4 B.MX1
N$53
  Bottom 0.152: D53.A 145.26,26.58 144.54,27.29 144.54,30.4 N.MX1
N$54
  Bottom 0.152: D54.A 164.31,26.58 163.59,27.29 163.59,30.4 M.MX1
N$55
  Bottom 0.152: D55.A 183.36,26.58 182.64,27.29 182.64,30.4 <.MX1
N$56
  Bottom 0.152: D56.A 202.41,26.58 201.69,27.29 201.69,30.4 >.MX1
N$57
  Bottom 0.152: RALT.MX1 199.16,12.62 203.69,12.62 205.5,10.81 205.5,8.07 D57.A
N$58
  Bottom 0.152: RWIN.MX1 U$8.MX1 219.43,11.47 217.95,11.47 216.81,10.33 216.81,8.72 217.95,7.58 220.27,7.58 D58.A
N$59
  Bottom 0.152: ?.MX1 220.03,31.1 220.7,30.43 220.7,26.2 D59.A
N$60
  Bottom 0.152: FN.MX1 272.49,31.12 273.04,31.67 277.51,31.67 279.32,29.86 279.32,27.12 D60.A
N$61
  Bottom 0.152: RCTRL.MX1 U$6.MX1 267.05,11.47 265.58,11.47 264.44,10.33 264.44,8.72 265.58,7.58 267.9,7.58 D61.A
N$62
  Bottom 0.152: MENU.MX1 U$7.MX1 243.24,11.47 241.77,11.47 240.63,10.33 240.63,8.72 241.77,7.58 244.08,7.58 D62.A
N$63
  Bottom 0.152: SPACE.MX1 127.16,12.11 127.66,12.62 132.25,12.62 132.8,12.07 SPACE7.MX1 139.06,11 139.74,10.33 139.74,8.02 D63.A
N$64
  Bottom 0.152: RSHIFT.MX1 248.2,31.12 248.75,31.67 251.31,31.67 251.86,31.12 RSHIFT2.MX1 257.72,31.12 258.27,31.67 260.84,31.67 262.65,29.86 262.65,27.29 260.84,25.48 254.83,25.48 D64.A
N$65  (1 unrouted)
  Bottom 0.152: C8.1 101.84,9.16 XTAL.3 103.26,10.06 104.15,10.94
N$66  (1 unrouted)
  Bottom 0.152: 105.87,9.44 105.44,9.02 105.44,7.74 104.43,6.73 89.68,6.73 R5.2
  Bottom 0.305: S1.2 86.65,9.73 R5.2
N$67
  Bottom 0.305: R7.1 10.64,40.56 CAPS.LED+
N$68  (1 unrouted)
N$69  (1 unrouted)
N$97
  Bottom 0.305: USB-C.B5 R1.1
N$98
  Bottom 0.305: R2.2 141.61,93.59 USB-C.A5
N$105
  Bottom 0.305: F13.1 149.65,90.98 FB1.1
N$106
  Bottom 0.305: USB-C.S2 USB-C.S4 USB-C.S3 USB-C.S1 138.54,94.36 137.85,93.66 FB2.1
ROW1  (via drill 0.35)  (1 unrouted)
  Top 0.152: v83.37,78.28 83.37,57.21 89.63,50.95 89.63,40.15 99.34,30.45 99.34,8.71 104.71,3.34 v106.87,3.34 | v132.23,79.3 138,79.3 v138.04,79.33
  Bottom 0.152: D1.C D2.C D3.C D4.C D5.C | D5.C D6.C D7.C 132.2,79.33 v132.23,79.3 | D26.C 257.33,79.33 256.08,80.58 253.52,80.58 252.27,79.33 D25.C D24.C D23.C D22.C D21.C D20.C v138.04,79.33 | D5.C 83.34,78.31 v83.37,78.28 | 108.67,7.4 107.97,6.7 107.97,4.45 v106.87,3.34
ROW2  (via drill 0.35)  (1 unrouted)
  Top 0.152: v84.17,60.28 84.17,56.91 89.96,51.12 89.96,40.25 99.64,30.58 99.64,8.96 104.47,4.14 v106.36,4.14 | v121.84,60.28 127.93,60.28 v127.96,60.3
  Bottom 0.152: D8.C D9.C D10.C D11.C v84.17,60.28 D12.C D13.C v121.83,60.28 v121.84,60.28 | D29.C D28.C D19.C D18.C D17.C D16.C D15.C D14.C 130.94,60.3 v127.96,60.3 | v106.36,4.14 107.67,5.45 107.67,6.91 108.17,7.41
ROW3  (via drill 0.35)  (1 unrouted)
  Top 0.152: v105.79,4.91 104.21,4.91 99.95,9.18 99.95,30.72 90.67,39.99 v90.67,41.23 | v126.94,41.22 132.45,41.22 v132.47,41.24
  Bottom 0.152: D43.C D42.C D41.C D40.C v90.67,41.23 D39.C D38.C 126.93,41.23 v126.94,41.22 | D27.C 271.46,71.05 274.55,67.96 274.55,65.39 271.46,62.3 271.46,52.44 267.41,48.38 267.41,46.34 265.6,44.53 265.24,44.53 D31.C 254.95,41.23 253.7,42.48 251.14,42.48 249.89,41.23 D32.C D33.C D34.C D35.C D36.C D37.C 135.72,41.24 v132.47,41.24 | v105.79,4.91 107.34,6.46 107.34,7.04 107.67,7.37
ROW4  (via drill 0.35)  (1 unrouted)
  Top 0.152: v100.56,22.18 100.56,22.06 100.25,21.75 100.25,9.3 103.84,5.72 v105.28,5.72 | v118.39,22.18 124.67,22.18 v124.69,22.2
  Bottom 0.152: D44.C 30.8,22.18 32.05,23.43 34.61,23.43 35.86,22.18 D45.C D48.C D50.C v100.56,22.18 D51.C v118.39,22.18 | D52.C 126.27,22.18 | 126.27,22.18 D53.C D54.C D55.C D56.C D59.C 245.13,22.18 246.37,23.43 248.94,23.43 250.19,22.18 D64.C 268.93,22.18 270.17,23.43 272.74,23.43 273.99,22.18 D60.C | v105.28,5.72 105.59,5.72 107.17,7.3 | v124.69,22.2 126.25,22.2 126.27,22.18
ROW5  (via drill 0.35)  (1 unrouted)
  Top 0.152: v88.31,6.61 95.93,14.23 v95.93,17.36
  Bottom 0.152: D46.C D47.C D49.C 77.87,3.13 79.88,5.14 86.81,5.14 86.86,5.1 | 86.86,5.1 90.37,1.58 136.56,1.58 D63.C 177.87,3.13 179.88,5.14 201.11,5.14 203.12,3.13 D57.C D58.C D62.C D61.C | 86.86,5.1 86.86,5.16 v88.31,6.61 | v95.93,17.36 95.93,19.09 97.27,20.42 106.18,20.42 108.72,17.88 108.72,16.72 108.17,16.16
VBUS  (via drill 0.35)
  Top 0.305: v146.74,92.21 145.48,93.47 v140.4,93.47 140.4,93.42 136.14,93.42 v133.4,90.68
  Bottom 0.305: v140.4,93.47 140.41,93.49 USB-C.A4B9 140.41,95.55 141.24,96.37 144.47,96.37 145.31,95.53 USB-C.B4A9 145.47,94.73 145.47,92.69 145.81,92.35 146.6,92.35 v146.74,92.21 F13.2 | U$2.4 133.41,90.67 v133.4,90.68
VCC  (via drill 0.35)  (8 unrouted)
  Top 0.305: v113.01,14.83 113.01,16.11 111.69,17.44 v108.11,17.44 108.11,17.42 105.05,14.36 v105.05,9.5 105.05,8.56 106.78,6.84 v108.98,6.84 112.97,6.84 v113.03,6.9 | v123.21,21.42 123.21,19.1 v123.26,19.06
  Bottom 0.305: 107.67,15.94 107.18,16.42 C4.2 108.11,17.38 v108.11,17.44 | v113.02,14.82 v113.01,14.83 | 105.47,9.94 105.05,9.52 v105.05,9.5 105.06,9.49 105.06,8.93 103.79,7.67 C5.2 103.68,7.38 100.98,7.38 98.62,9.74 R5.1 | v113.03,6.9 113.02,6.92 | v113.01,14.83 113.73,15.55 C1.2 119.74,15.55 v123.26,19.06 | v113.01,14.83 | 109.17,7.03 v108.98,6.84 108.98,5.97 C3.2 | v113.03,6.9 112.97,6.84 112.36,6.84 111.67,7.53 | FB1.2 147.8,88.74 149.97,86.56 149.97,83.77 148.04,81.84 138.96,81.84 126.28,69.16 126.27,69.16 126.25,69.13 126.25,56.86 131.01,52.1 131.01,38.1 137.47,31.64 137.47,27.16 134.11,23.8 124.87,23.8 123.19,22.12 123.19,21.44 v123.21,21.42 | v113.03,6.9 114.16,6.9 114.51,7.25 C2.2